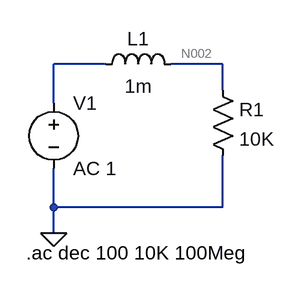
[diagram p0: schematic Circuit1.asc]
Circuit1.asc, the LTspice schematic file:
Version 4
SHEET 1 880 680
WIRE 160 32 96 32
WIRE 304 32 240 32
WIRE 304 64 304 32
WIRE 96 80 96 32
WIRE 96 208 96 160
WIRE 304 208 304 144
WIRE 304 208 96 208
WIRE 96 240 96 208
FLAG 96 240 0
SYMBOL voltage 96 64 R0
WINDOW 123 0 0 Left 0
WINDOW 39 0 0 Left 0
SYMATTR InstName V1
SYMATTR Value AC 1
SYMBOL ind 144 48 R270
WINDOW 0 32 56 VTop 2
WINDOW 3 5 56 VBottom 2
SYMATTR InstName L1
SYMATTR Value 1m
SYMBOL res 288 48 R0
SYMATTR InstName R1
SYMATTR Value 10K
TEXT 62 264 Left 2 !.ac dec 100 10K 100Meg

The netlist it stands for:
* Circuit1.asc
V1 N001 0 AC 1
L1 N001 N002 1m
R1 N002 0 10K
.ac dec 100 10K 100Meg
.backanno
.end

* Results of the author's LTspice run, read from the files saved beside the schematic
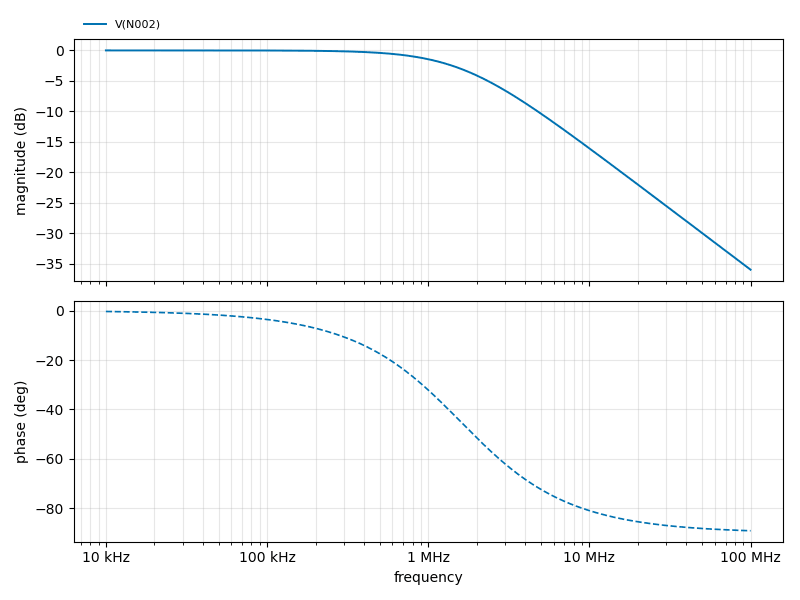
[diagram p1: AC Analysis of Circuit1.asc, plotted from the saved traces]
* AC Analysis, 1 run:
*   V(N002): -0.00 dB at 10 kHz, -35.96 dB at 100 MHz, peak -0.00 dB at 10 kHz, 3 dB below the peak at 1.592 MHz